# EAGLE design greedy (EAGLE 8.5.0)
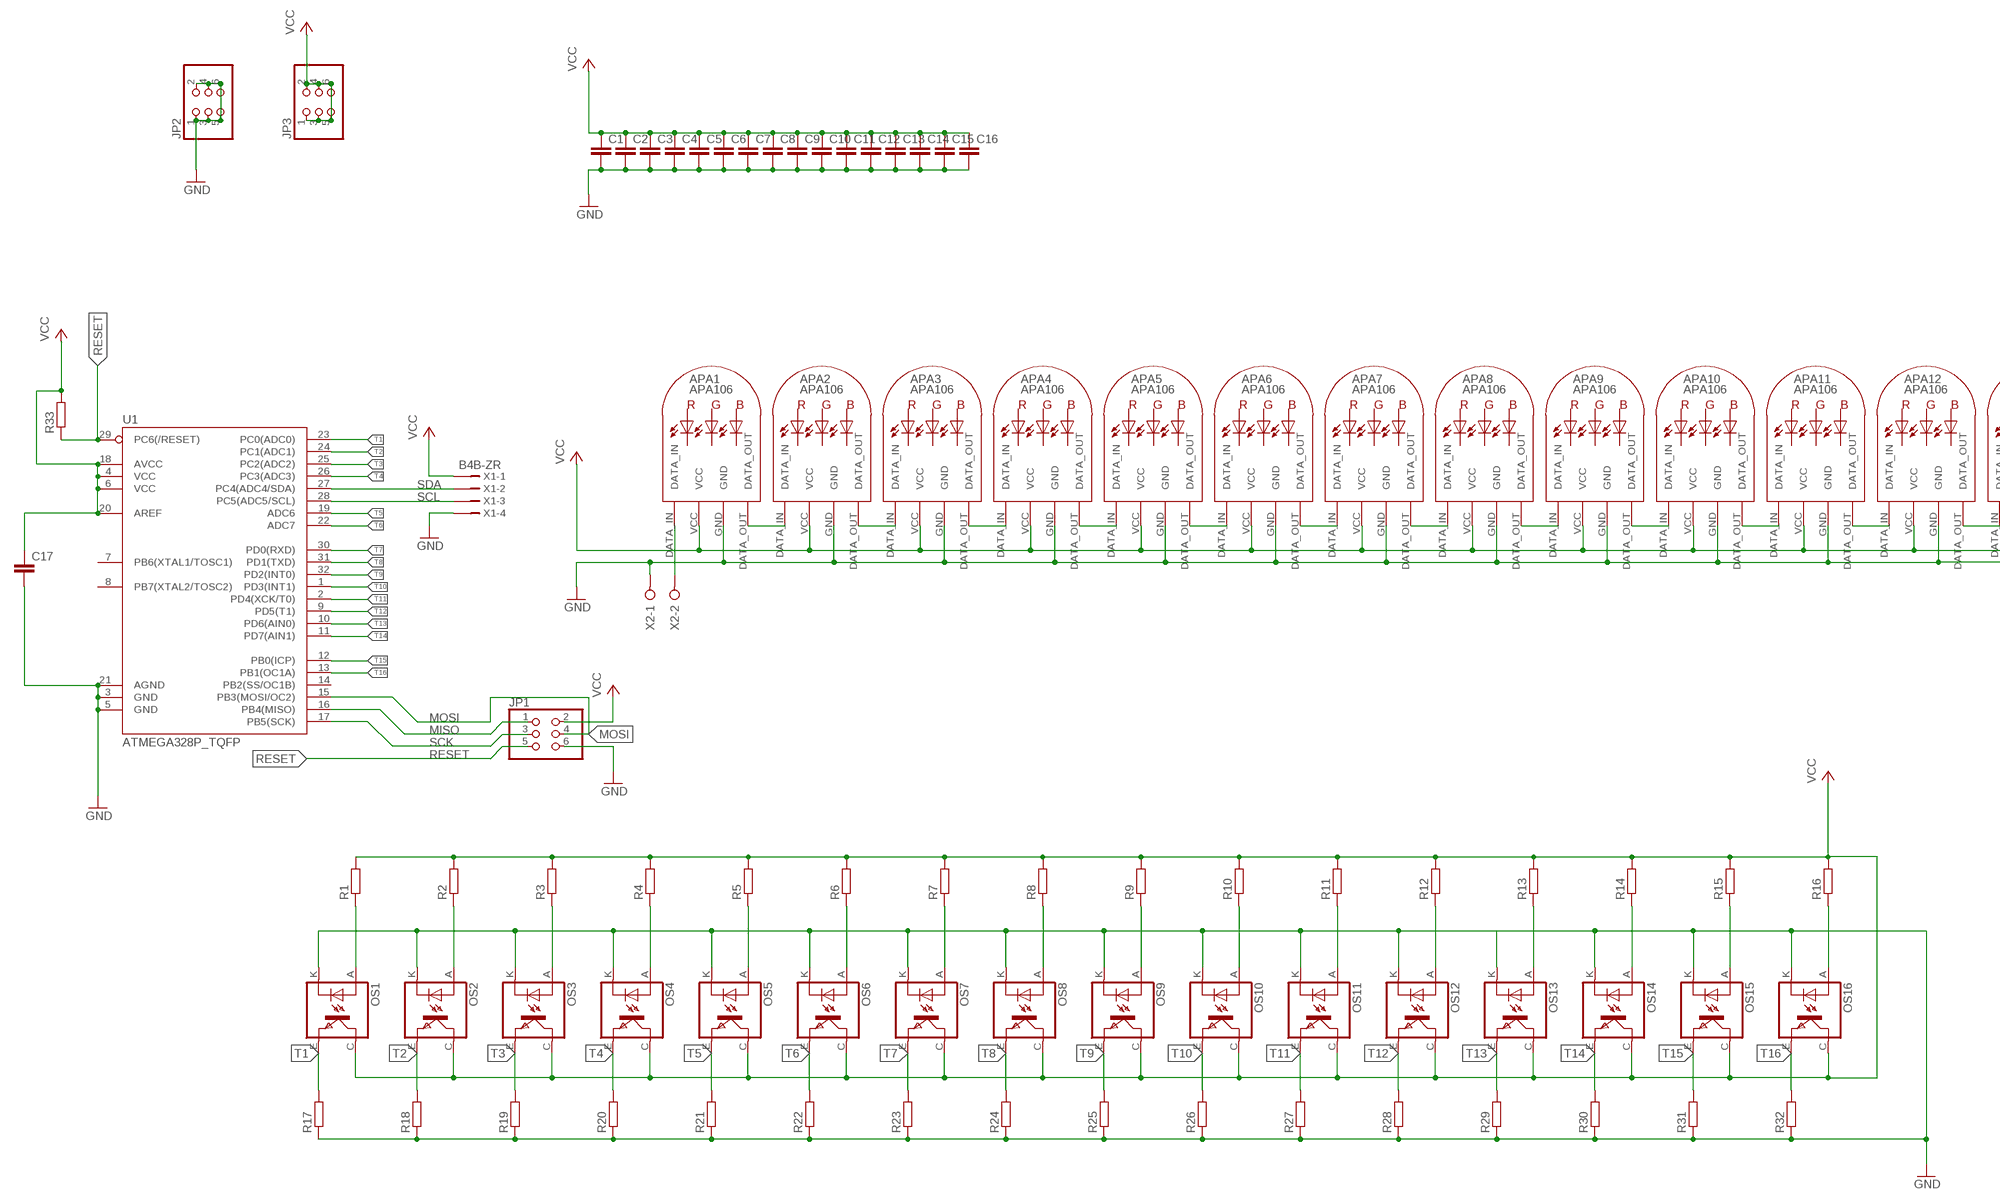
[diagram p0: schematic, sheet 1, part 1 of 2]
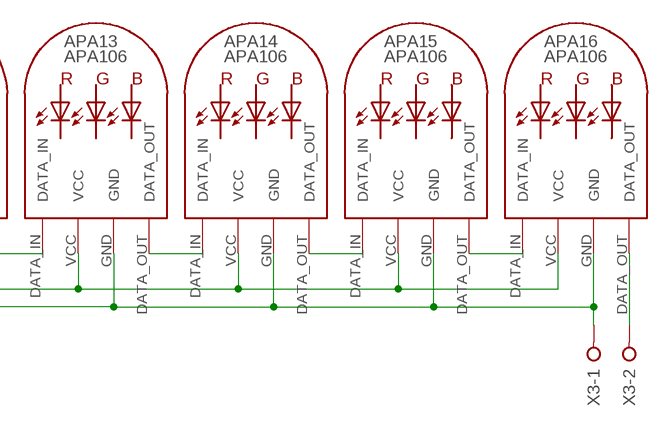
[diagram p1: schematic, sheet 1, part 2 of 2]

## Parts
APA1  APA106  [APA_106_8MM]
APA2  APA106  [APA_106_8MM]
APA3  APA106  [APA_106_8MM]
APA4  APA106  [APA_106_8MM]
APA5  APA106  [APA_106_8MM]
APA6  APA106  [APA_106_8MM]
APA7  APA106  [APA_106_8MM]
APA8  APA106  [APA_106_8MM]
APA9  APA106  [APA_106_8MM]
APA10  APA106  [APA_106_8MM]
APA11  APA106  [APA_106_8MM]
APA12  APA106  [APA_106_8MM]
APA13  APA106  [APA_106_8MM]
APA14  APA106  [APA_106_8MM]
APA15  APA106  [APA_106_8MM]
APA16  APA106  [APA_106_8MM]
C1  C5/3  [C5B3]
C2  C5/3  [C5B3]
C3  C5/3  [C5B3]
C4  C5/3  [C5B3]
C5  C5/3  [C5B3]
C6  C5/3  [C5B3]
C7  C5/3  [C5B3]
C8  C5/3  [C5B3]
C9  C5/3  [C5B3]
C10  C5/3  [C5B3]
C11  C5/3  [C5B3]
C12  C5/3  [C5B3]
C13  C5/3  [C5B3]
C14  C5/3  [C5B3]
C15  C5/3  [C5B3]
C16  C5/3  [C5B3]
C17  C-EU025-025X050  [C025-025X050]
JP1  PINHD-2X3  [2X03]
JP2  PINHD-2X3  [2X03]
JP3  PINHD-2X3  [2X03]
OS1  TCRT5000  [TCRT5000]
OS2  TCRT5000  [TCRT5000]
OS3  TCRT5000  [TCRT5000]
OS4  TCRT5000  [TCRT5000]
OS5  TCRT5000  [TCRT5000]
OS6  TCRT5000  [TCRT5000]
OS7  TCRT5000  [TCRT5000]
OS8  TCRT5000  [TCRT5000]
OS9  TCRT5000  [TCRT5000]
OS10  TCRT5000  [TCRT5000]
OS11  TCRT5000  [TCRT5000]
OS12  TCRT5000  [TCRT5000]
OS13  TCRT5000  [TCRT5000]
OS14  TCRT5000  [TCRT5000]
OS15  TCRT5000  [TCRT5000]
OS16  TCRT5000  [TCRT5000]
R1  R-EU_R0805  [R0805]
R2  R-EU_R0805  [R0805]
R3  R-EU_R0805  [R0805]
R4  R-EU_R0805  [R0805]
R5  R-EU_R0805  [R0805]
R6  R-EU_R0805  [R0805]
R7  R-EU_R0805  [R0805]
R8  R-EU_R0805  [R0805]
R9  R-EU_R0805  [R0805]
R10  R-EU_R0805  [R0805]
R11  R-EU_R0805  [R0805]
R12  R-EU_R0805  [R0805]
R13  R-EU_R0805  [R0805]
R14  R-EU_R0805  [R0805]
R15  R-EU_R0805  [R0805]
R16  R-EU_R0805  [R0805]
R17  R-EU_R0805  [R0805]
R18  R-EU_R0805  [R0805]
R19  R-EU_R0805  [R0805]
R20  R-EU_R0805  [R0805]
R21  R-EU_R0805  [R0805]
R22  R-EU_R0805  [R0805]
R23  R-EU_R0805  [R0805]
R24  R-EU_R0805  [R0805]
R25  R-EU_R0805  [R0805]
R26  R-EU_R0805  [R0805]
R27  R-EU_R0805  [R0805]
R28  R-EU_R0805  [R0805]
R29  R-EU_R0805  [R0805]
R30  R-EU_R0805  [R0805]
R31  R-EU_R0805  [R0805]
R32  R-EU_R0805  [R0805]
R33  R-EU_R0805  [R0805]
U1  ATMEGA328P_TQFP  [TQFP32-08]
X1  B4B-ZR  [B4B-ZR]
X2  W237-02P  [W237-132]
X3  W237-02P  [W237-132]

## Nets
GND: APA1.GND APA2.GND APA3.GND APA4.GND APA5.GND APA6.GND APA7.GND APA8.GND APA9.GND APA10.GND APA11.GND APA12.GND APA13.GND APA14.GND APA15.GND APA16.GND C1.2 C2.2 C3.2 C4.2 C5.2 C6.2 C7.2 C8.2 C9.2 C10.2 C11.2 C12.2 C13.2 C14.2 C15.2 C16.2 C17.2 JP1.6 JP2.1 JP2.2 JP2.3 JP2.4 JP2.5 JP2.6 OS1.K(CATHODE) OS2.K(CATHODE) OS3.K(CATHODE) OS4.K(CATHODE) OS5.K(CATHODE) OS6.K(CATHODE) OS7.K(CATHODE) OS8.K(CATHODE) OS9.K(CATHODE) OS10.K(CATHODE) OS11.K(CATHODE) OS12.K(CATHODE) OS13.K(CATHODE) OS14.K(CATHODE) OS15.K(CATHODE) OS16.K(CATHODE) R17.1 R17.11 R18.1 R18.11 R19.1 R19.11 R20.1 R20.11 R21.1 R21.11 R22.1 R22.11 R23.1 R23.11 R24.1 R24.11 R25.1 R25.11 R26.1 R26.11 R27.1 R27.11 R28.1 R28.11 R29.1 R29.11 R30.1 R30.11 R31.1 R31.11 R32.1 R32.11 U1.3(GND) U1.5(GND) U1.21(AGND) X1.4 X2.1 X3.1
MISO: JP1.1 U1.16(PB4(MISO))
MOSI: JP1.4 U1.15(PB3(MOSI/OC2))
N$1: APA1.DATA_IN X2.2
N$2: OS1.A(ANODE) R1.1 R1.11
N$3: OS2.A(ANODE) R2.1 R2.11
N$4: OS3.A(ANODE) R3.1 R3.11
N$5: OS4.A(ANODE) R4.1 R4.11
N$6: OS5.A(ANODE) R5.1 R5.11
N$7: OS6.A(ANODE) R6.1 R6.11
N$8: OS7.A(ANODE) R7.1 R7.11
N$9: OS8.A(ANODE) R8.1 R8.11
N$10: OS9.A(ANODE) R9.1 R9.11
N$11: OS10.A(ANODE) R10.1 R10.11
N$12: OS11.A(ANODE) R11.1 R11.11
N$13: OS12.A(ANODE) R12.1 R12.11
N$14: OS13.A(ANODE) R13.1 R13.11
N$15: OS14.A(ANODE) R14.1 R14.11
N$16: OS15.A(ANODE) R15.1 R15.11
N$17: OS16.A(ANODE) R16.1 R16.11
N$18: APA16.DATA_OUT X3.2
N$33: APA1.DATA_OUT APA2.DATA_IN
N$34: APA2.DATA_OUT APA3.DATA_IN
N$35: APA3.DATA_OUT APA4.DATA_IN
N$36: APA4.DATA_OUT APA5.DATA_IN
N$37: APA5.DATA_OUT APA6.DATA_IN
N$38: APA6.DATA_OUT APA7.DATA_IN
N$39: APA7.DATA_OUT APA8.DATA_IN
N$40: APA8.DATA_OUT APA9.DATA_IN
N$41: APA9.DATA_OUT APA10.DATA_IN
N$42: APA10.DATA_OUT APA11.DATA_IN
N$43: APA11.DATA_OUT APA12.DATA_IN
N$44: APA12.DATA_OUT APA13.DATA_IN
N$45: APA13.DATA_OUT APA14.DATA_IN
N$46: APA14.DATA_OUT APA15.DATA_IN
N$47: APA15.DATA_OUT APA16.DATA_IN
RESET: JP1.5 R33.1 R33.11 U1.29(PC6(/RESET))
SCK: JP1.3 U1.17(PB5(SCK))
SCL: U1.28(PC5(ADC5/SCL)) X1.3
SDA: U1.27(PC4(ADC4/SDA)) X1.2
T1: OS1.E(EMITTER) R17.2 R17.21 U1.23(PC0(ADC0))
T2: OS2.E(EMITTER) R18.2 R18.21 U1.24(PC1(ADC1))
T3: OS3.E(EMITTER) R19.2 R19.21 U1.25(PC2(ADC2))
T4: OS4.E(EMITTER) R20.2 R20.21 U1.26(PC3(ADC3))
T5: OS5.E(EMITTER) R21.2 R21.21 U1.19(ADC6)
T6: OS6.E(EMITTER) R22.2 R22.21 U1.22(ADC7)
T7: OS7.E(EMITTER) R23.2 R23.21 U1.30(PD0(RXD))
T8: OS8.E(EMITTER) R24.2 R24.21 U1.31(PD1(TXD))
T9: OS9.E(EMITTER) R25.2 R25.21 U1.32(PD2(INT0))
T10: OS10.E(EMITTER) R26.2 R26.21 U1.1(PD3(INT1))
T11: OS11.E(EMITTER) R27.2 R27.21 U1.2(PD4(XCK/T0))
T12: OS12.E(EMITTER) R28.2 R28.21 U1.9(PD5(T1))
T13: OS13.E(EMITTER) R29.2 R29.21 U1.10(PD6(AIN0))
T14: OS14.E(EMITTER) R30.2 R30.21 U1.11(PD7(AIN1))
T15: OS15.E(EMITTER) R31.2 R31.21 U1.12(PB0(ICP))
T16: OS16.E(EMITTER) R32.2 R32.21 U1.13(PB1(OC1A))
VCC: APA1.VCC APA2.VCC APA3.VCC APA4.VCC APA5.VCC APA6.VCC APA7.VCC APA8.VCC APA9.VCC APA10.VCC APA11.VCC APA12.VCC APA13.VCC APA14.VCC APA15.VCC APA16.VCC C1.1 C2.1 C3.1 C4.1 C5.1 C6.1 C7.1 C8.1 C9.1 C10.1 C11.1 C12.1 C13.1 C14.1 C15.1 C16.1 C17.1 JP1.2 JP3.1 JP3.2 JP3.3 JP3.4 JP3.5 JP3.6 OS1.C(COLLECTOR) OS2.C(COLLECTOR) OS3.C(COLLECTOR) OS4.C(COLLECTOR) OS5.C(COLLECTOR) OS6.C(COLLECTOR) OS7.C(COLLECTOR) OS8.C(COLLECTOR) OS9.C(COLLECTOR) OS10.C(COLLECTOR) OS11.C(COLLECTOR) OS12.C(COLLECTOR) OS13.C(COLLECTOR) OS14.C(COLLECTOR) OS15.C(COLLECTOR) OS16.C(COLLECTOR) R1.2 R1.21 R2.2 R2.21 R3.2 R3.21 R4.2 R4.21 R5.2 R5.21 R6.2 R6.21 R7.2 R7.21 R8.2 R8.21 R9.2 R9.21 R10.2 R10.21 R11.2 R11.21 R12.2 R12.21 R13.2 R13.21 R14.2 R14.21 R15.2 R15.21 R16.2 R16.21 R33.2 R33.21 U1.4(VCC) U1.6(VCC) U1.18(AVCC) U1.20(AREF) X1.1
Unconnected: U1.7(PB6(XTAL1/TOSC1)) U1.8(PB7(XTAL2/TOSC2)) U1.14(PB2(SS/OC1B))

## Library data of the parts
APA1-APA16 = apa106:APA106
C1-C16 = capacitor-wima:C: CAPACITOR naming: grid - package width
C17 = rcl:C-EU: CAPACITOR, European symbol; SPICEPREFIX: C
JP1-JP3 = pinhead:PINHD-2X3: PIN HEADER
OS1-OS16 = tcrt5000:TCRT5000
R1-R33 = rcl:R-EU_: RESISTOR, European symbol; SPICEPREFIX: R
U1 = SparkFun-IC-Microcontroller:ATMEGA328P_TQFP: Popular 328P in QFP Storefront component: ATmega328 - TQFP <https://www.sparkfun.com/products/13448> (COM-13448) Datasheet <http://www.sparkfun.com/datasheets/Components/SMD/ATMega328.pdf> SparkFun Products SparkFun RedBoard - Programmed with Arduino <https://www.sparkfun.com/products/12757> (DEV-12757) Arduino Pro Mini 328 - 5V/16MHz <https://www.sparkfun.com/products/11113> (DEV-11113) Arduino Pro Mini 328 - 3.3V/8MHz <https://www.sparkfun.com/products/11114> (DEV-11114) SparkFun OpenLog <https://www.sparkfun.com/products/13712> (DEV-13712) SparkFun MicroView - OLED Arduino Module <https://www.sparkfun.com/products/12923> (DEV-12923) SparkFun Digital Sandbox <https://www.sparkfun.com/products/12651> (DEV-12651) SparkFun PicoBoard <https://www.sparkfun.com/products/11888> (WIG-11888) Arduino Fio <https://www.sparkfun.com/products/10116> (DEV-10116) LilyPad Arduino 328 Main Board <https://www.sparkfun.com/products/13342> (DEV-13342) SparkFun RedStick <https://www.sparkfun.com/products/13741> (DEV-13741) LilyPad MP3 <https://www.sparkfun.com/products/11013> (DEV-11013) LilyPad Arduino SimpleSnap <https://www.sparkfun.com/products/10941> (DEV-10941) SparkFun Stepoko <https://www.sparkfun.com/products/13899> (ROB-13899) SparkFun Geiger Counter <https://www.sparkfun.com/products/11345> (SEN-11345) SparkFun EL Sequencer <https://www.sparkfun.com/products/12781> (COM-12781) Arduino Pro 328 - 5V/16MHz <https://www.sparkfun.com/products/10915> (DEV-10915) CryptoCape <https://www.sparkfun.com/products/12773> (DEV-12773) SparkFun IR Thermometer Evaluation Board - MLX90614 <https://www.sparkfun.com/products/10740> (SEN-10740) SparkFun RedBot Mainboard <https://www.sparkfun.com/products/12097> (ROB-12097) Arduino Pro 328 - 3.3V/8MHz <https://www.sparkfun.com/products/10914> (DEV-10914) SparkFun Block for Intel® Edison - Arduino <https://www.sparkfun.com/products/13036> (DEV-13036) SparkFun Simon Says - Surface Mount Soldering Kit <https://www.sparkfun.com/products/10935> (KIT-10935) SparkFun 7-Segment Serial Display - Red <https://www.sparkfun.com/products/11441> (COM-11441) SparkFun 7-Segment Serial Display - White <https://www.sparkfun.com/products/11629> (COM-11629) SparkFun 7-Segment Serial Display - Yellow <https://www.sparkfun.com/products/11443> (COM-11443) SparkFun 7-Segment Serial Display - Kelly Green <https://www.sparkfun.com/products/11440> (COM-11440) SparkFun 7-Segment Serial Display - Blue <https://www.sparkfun.com/products/11442> (COM-11442) SparkFun OpenSegment Serial Display - 20mm (Blue) <https://www.sparkfun.com/products/11647> (COM-11647) SparkFun OpenSegment Serial Display - 20mm (Green) <https://www.sparkfun.com/products/11646> (COM-11646) SparkFun OpenSegment Serial Display - 20mm (White) <https://www.sparkfun.com/products/11648> (COM-11648) SparkFun OpenSegment Serial Display - 20mm (Red) <https://www.sparkfun.com/products/11644> (COM-11644) SparkFun OpenSegment Serial Display - 20mm (Yellow) <https://www.sparkfun.com/products/11645> (COM-11645) SparkFun OpenSegment Shield <https://www.sparkfun.com/products/13190> (DEV-13190); PROD_ID: IC-09069
X1 = alldevads1262_teensy_ftdi_ref:?4B-ZR: ZH CONNECTOR 1.5 mm, 4 pin 1 row Source: http://www.jst.com .. eZH.pdf; MF: FARNELL; MPN: B4B-ZR(LF)(SN); OC_FARNELL: 1830916; OC_NEWARK: 37K9960
X2 X3 = con-wago-508:W237-02P: WAGO SREW CLAMP; OC_FARNELL: unknown; OC_NEWARK: unknown

## Board
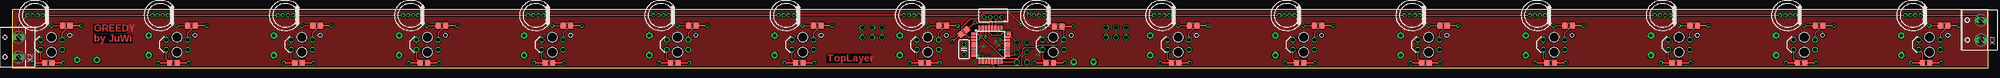
[diagram p2: board, top side]
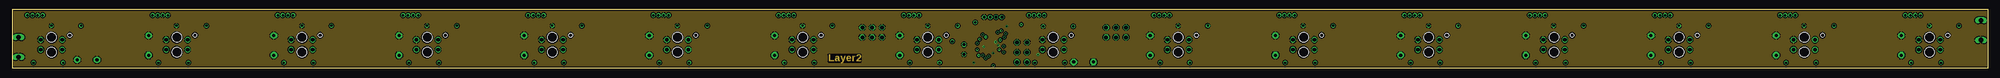
[diagram p3: board, inner layer Route2]
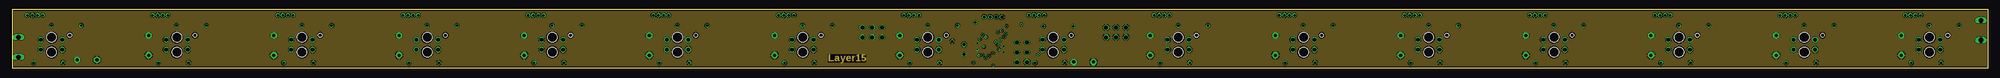
[diagram p4: board, inner layer Route15]
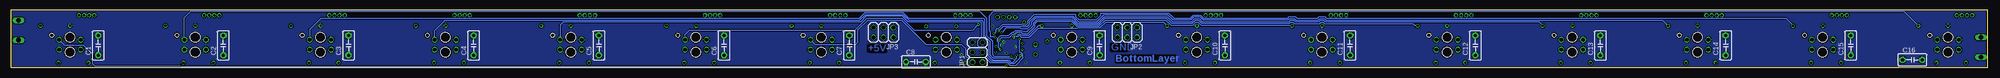
[diagram p5: board, bottom side, seen from below]

Size 505 x 15 mm. Coordinates in mm from the lower left corner, seen from the top.
Outline: 0,0 505,0 505,15 0,15 0,0
Copper layers (1+2*15+16): Top 0.035mm / dielectric 0.39mm / Route2 0.035mm / dielectric 0.39mm / Route15 0.035mm / dielectric 0.39mm / Bottom 0.035mm
Design rules "greedy *": minimum track width 0.15mm, minimum drill 0.35mm, track to track 0.15mm, track to pad 0.15mm, pad to pad 0.15mm, via to via 0.15mm, smd to smd 0mil, copper to edge 0.3mm, drill to drill 0.6mm, minimum pad ring 0.15mm, minimum via ring 0.15mm, stop-mask expansion 0.01mm, vias tented up to drill 32mil, thermal gap 10mil

### Footprints (pad centres in the part's own frame; a part is rotated, then mirrored left to right if it is on the bottom)
APA_106_8MM = drill 0.6 pad 1: DATA_IN -1.95,0; DATA_OUT 1.95,0; GND 0.65,0; VCC -0.65,0
C5B3 = drill 0.813 pad 1.6 octagon: 1 -2.54,0; 2 2.54,0
C025-025X050 = drill 0.813 octagon: 1 -1.27,0; 2 1.27,0
2X03 = drill 1.016 octagon: 1 -2.54,-1.27; 2 -2.54,1.27; 3 0,-1.27; 4 0,1.27; 5 2.54,-1.27; 6 2.54,1.27
TCRT5000 = drill 1: A -2.75,-1.27; K -2.75,1.27 | drill 1 octagon: C 2.75,-1.27; E 2.75,1.27 | hole 2.5: 0,-1.9; 0,1.9 | hole 1: 4.65,2.45
R0805 = smd 1.3 x 1.5: 1 -0.95,0; 2 0.95,0 | drill 0.6: 11 -3.81,0; 21 3.81,0
TQFP32-08 = smd 1.27 x 0.559: 1 -4.293,2.8; 2 -4.293,2; 3 -4.293,1.2; 4 -4.293,0.4; 5 -4.293,-0.4; 6 -4.293,-1.2; 7 -4.293,-2; 8 -4.293,-2.8; 17 4.293,-2.8; 18 4.293,-2; 19 4.293,-1.2; 20 4.293,-0.4; 21 4.293,0.4; 22 4.293,1.2; 23 4.293,2; 24 4.293,2.8 | smd 0.559 x 1.27: 9 -2.8,-4.293; 10 -2,-4.293; 11 -1.2,-4.293; 12 -0.4,-4.293; 13 0.4,-4.293; 14 1.2,-4.293; 15 2,-4.293; 16 2.8,-4.293; 25 2.8,4.293; 26 2,4.293; 27 1.2,4.293; 28 0.4,4.293; 29 -0.4,4.293; 30 -1.2,4.293; 31 -2,4.293; 32 -2.8,4.293
B4B-ZR = drill 0.7 pad 1.1: 1 -2.25,0; 2 -0.75,0; 3 0.75,0; 4 2.25,0
W237-132 = drill 1.194 long: 1 -2.54,-0.635; 2 2.54,-0.635

### Placement (x,y rotation side)
APA1  5.76,13.56 0 top
APA2  37.76,13.56 0 top
APA3  69.76,13.56 0 top
APA4  101.76,13.56 0 top
APA5  133.76,13.56 0 top
APA6  165.76,13.56 0 top
APA7  197.76,13.56 0 top
APA8  229.76,13.56 0 top
APA9  261.76,13.56 0 top
APA10  293.76,13.56 0 top
APA11  325.76,13.56 0 top
APA12  357.76,13.56 0 top
APA13  389.76,13.56 0 top
APA14  421.76,13.56 0 top
APA15  453.76,13.56 0 top
APA16  485.76,13.56 0 top
C1  482.8,5.83 90 bottom
C2  450.8,5.83 90 bottom
C3  418.8,5.83 90 bottom
C4  386.8,5.83 90 bottom
C5  354.8,5.83 90 bottom
C6  322.8,5.83 90 bottom
C7  290.8,5.83 90 bottom
C8  273.78,1.55 0 bottom
C9  226.8,5.83 90 bottom
C10  194.8,5.83 90 bottom
C11  162.8,5.83 90 bottom
C12  130.8,5.83 90 bottom
C13  98.8,5.83 90 bottom
C14  66.8,5.83 90 bottom
C15  34.8,5.83 90 bottom
C16  19.07,2.09 0 bottom
C17  243.23,4.78 270 top
JP1  258.06,4.06 90 bottom
JP2  219.76,9.17 180 bottom
JP3  282.09,9.17 180 bottom
OS1  10,6 0 top
OS2  42,6 0 top
OS3  74,6 0 top
OS4  106,6 0 top
OS5  138,6 0 top
OS6  170,6 0 top
OS7  202,6 0 top
OS8  234,6 0 top
OS9  266,6 0 top
OS10  298,6 0 top
OS11  330,6 0 top
OS12  362,6 0 top
OS13  394,6 0 top
OS14  426,6 0 top
OS15  458,6 0 top
OS16  490,6 0 top
R1  9.14,1.36 0 top
R2  41.14,1.36 0 top
R3  73.14,1.36 0 top
R4  105.14,1.36 0 top
R5  137.14,1.36 0 top
R6  169.14,1.36 0 top
R7  201.14,1.36 0 top
R8  233.14,1.36 0 top
R9  265.14,1.36 0 top
R10  297.14,1.36 0 top
R11  329.14,1.36 0 top
R12  361.14,1.36 0 top
R13  393.14,1.36 0 top
R14  425.14,1.36 0 top
R15  457.14,1.36 0 top
R16  489.14,1.36 0 top
R17  13.75,10.91 0 top
R18  45.75,10.91 0 top
R19  77.75,10.91 0 top
R20  109.75,10.91 0 top
R21  141.75,10.91 0 top
R22  173.75,10.91 0 top
R23  205.75,10.91 0 top
R24  237.75,10.91 0 top
R25  267.32,10.7 0 top
R26  301.75,10.91 0 top
R27  333.75,10.91 0 top
R28  365.75,10.91 0 top
R29  397.75,10.91 0 top
R30  429.75,10.91 0 top
R31  461.75,10.91 0 top
R32  493.75,10.91 0 top
R33  243.17,9.3 220 top
U1  250,6 0 top
X1  250.65,13.11 180 top
X2  0.91,5.38 90 top
X3  502.51,9.75 90 top

### Tracks (layer width: path | path; a pad name or v marks a point on that pad's centre or on a via)
GND  (via drill 0.35)
  other vias: 248.31,5.44 250.65,3.81 251.31,6.71 251.92,5.84 245.67,1.37 254.15,10.77 262.13,3.45
  pour Bottom (isolate 0.254, rank 6): 0,15 505,15 505,0 0,0
  pour Route2 (isolate 0.254): 0,15 505,15 505,0 0,0
  pour Top (isolate 0.254): 0,15 505,15 505,0 0,0
  pour Route2 (isolate 0.254): 0,15 505,15 505,0 0,0
  cutout Bottom: 219.2,4.27 224.08,4.27 224.08,6.3 219.2,6.3
  cutout Bottom: 286.11,6.1 281.23,6.1 281.23,4.06 286.11,4.06
MISO
  Top 0.254: JP1.1 252.98,1.52 U1.16
MOSI
  Top 0.254: JP1.4 257.96,2.69 257.96,0.61 257.86,0.51 252.07,0.51 251.97,0.61 251.97,1.68 U1.15
N$1
  Top 0.254: APA1.DATA_IN 1.55,10.98 X2.2
N$2
  Top 0.254: OS1.A 7.25,2.3 R1.1 R1.11
N$3
  Top 0.254: OS2.A 39.25,2.3 R2.1 R2.11
N$4
  Top 0.254: OS3.A 71.25,2.3 R3.1 R3.11
N$5
  Top 0.254: OS4.A 103.25,2.3 R4.1 R4.11
N$6
  Top 0.254: OS5.A 135.25,2.3 R5.1 R5.11
N$7
  Top 0.254: OS6.A 167.25,2.3 R6.1 R6.11
N$8
  Top 0.254: OS7.A 199.25,2.3 R7.1 R7.11
N$9
  Top 0.254: OS8.A 231.25,2.3 R8.1 R8.11
N$10
  Top 0.254: OS9.A 263.25,2.3 R9.1 R9.11
N$11
  Top 0.254: OS10.A 295.25,2.3 R10.1 R10.11
N$12
  Top 0.254: OS11.A 327.25,2.3 R11.1 R11.11
N$13
  Top 0.254: OS12.A 359.25,2.3 R12.1 R12.11
N$14
  Top 0.254: OS13.A 391.25,2.3 R13.1 R13.11
N$15
  Top 0.254: OS14.A 423.25,2.3 R14.1 R14.11
N$16
  Top 0.254: OS15.A 455.25,2.3 R15.1 R15.11
N$17
  Top 0.254: OS16.A 488.09,3.89 488.09,1.25 | 488.09,0.71 488.09,1.25 | 488.09,1.25 R16.1 R16.11
N$18
  Top 0.254: APA16.DATA_OUT 501.88,13.56 X3.2
N$33
  Top 0.254: APA1.DATA_OUT APA2.DATA_IN
N$34
  Top 0.254: APA2.DATA_OUT APA3.DATA_IN
N$35
  Top 0.254: APA3.DATA_OUT APA4.DATA_IN
N$36
  Top 0.254: APA4.DATA_OUT APA5.DATA_IN
N$37
  Top 0.254: APA5.DATA_OUT APA6.DATA_IN
N$38
  Top 0.254: APA6.DATA_OUT APA7.DATA_IN
N$39
  Top 0.254: APA8.DATA_IN APA7.DATA_OUT
N$40
  Top 0.254: APA8.DATA_OUT 246.73,13.56 247.62,14.44 259.25,14.44 APA9.DATA_IN
N$41
  Top 0.254: APA9.DATA_OUT APA10.DATA_IN
N$42
  Top 0.254: APA10.DATA_OUT APA11.DATA_IN
N$43
  Top 0.254: APA11.DATA_OUT APA12.DATA_IN
N$44
  Top 0.254: APA12.DATA_OUT APA13.DATA_IN
N$45
  Top 0.254: APA13.DATA_OUT APA14.DATA_IN
N$46
  Top 0.254: APA14.DATA_OUT APA15.DATA_IN
N$47
  Top 0.254: APA15.DATA_OUT APA16.DATA_IN
RESET
  Top 0.254: JP1.5 255.26,8.14 255.26,9.22 255.06,9.41 253.55,9.41 253.14,9 252.53,8.38 250.39,8.38 249.6,9.18 U1.29 249.6,11.74 R33.11 R33.1
SCK
  Top 0.254: JP1.3 255.93,3.2 U1.17
SCL
  Top 0.254: X1.3 249.9,12.33 250.34,11.89 250.34,10.35 U1.28
SDA
  Top 0.254: X1.2 251.2,12.91 U1.27
T1  (via drill 0.35)
  Top 0.254: OS1.E 12.75,8.95 R17.2 R17.21 | v253.46,7.95 254.25,7.95 U1.23
  Bottom 0.254: R17.21 21.14,14.48 254.05,14.48 255.12,13.41 255.12,9.75 254.81,9.34 254.81,8.15 254,8.15 253.72,8.15 253.49,7.92 v253.46,7.95
T2  (via drill 0.35)
  Top 0.254: OS2.E 44.75,8.95 R18.2 R18.21 | v253.9,8.8 253.79,8.8 U1.24
  Bottom 0.254: R18.21 51.36,12.7 168.69,12.7 169.05,13.06 170.84,13.06 171.2,12.7 176.31,12.7 176.67,13.06 178.57,13.06 178.88,12.75 200.1,12.75 200.86,13.52 203.03,13.52 203.79,12.75 207.72,12.75 208.48,13.52 208.64,13.52 209.14,14.02 226.57,14.02 226.57,13.41 227.69,12.29 232.01,12.29 232.87,13.14 232.87,13.72 243.58,13.72 245.28,12.02 245.28,11.41 245.75,10.94 246.39,10.94 246.63,11.18 251.67,11.18 252.64,10.21 253.01,10.21 253.34,9.88 253.34,9.85 253.38,9.8 253.38,9.12 v253.9,8.8
T3  (via drill 0.35)
  Top 0.254: OS3.E 76.75,8.95 R19.2 R19.21 | v252.78,9.55 252.78,10.27 U1.25
  Bottom 0.254: R19.21 82.9,12.24 168.88,12.24 169.24,12.6 170.65,12.6 171.01,12.24 176.5,12.24 176.86,12.6 178.38,12.6 178.69,12.29 200.28,12.29 201.05,13.06 202.84,13.06 203.6,12.29 207.91,12.29 208.67,13.06 208.83,13.06 209.33,13.56 225.84,13.56 227.57,11.84 232.13,11.84 233.56,13.26 243.39,13.26 244.82,11.83 244.82,11.22 245.56,10.48 246.58,10.48 246.82,10.72 247.14,10.72 | v252.78,9.55 252.65,9.55 251.48,10.72 247.14,10.72 | 247.14,10.72
T4  (via drill 0.35)
  Top 0.254: OS4.E 108.75,8.95 R20.2 R20.21 | U1.26 v251.82,9.2
  Bottom 0.254: R20.21 114.44,11.79 169.07,11.79 169.43,12.14 170.46,12.14 170.82,11.79 176.69,11.79 177.05,12.14 178.19,12.14 178.5,11.84 200.47,11.84 201.24,12.6 202.65,12.6 203.41,11.84 208.09,11.84 208.86,12.6 209.02,12.6 209.52,13.11 225.73,13.11 227.4,11.44 232.3,11.44 233.67,12.8 243.2,12.8 244.37,11.64 244.37,11.03 245.38,10.02 246.77,10.02 247.01,10.26 250.75,10.26 v251.82,9.2
T5  (via drill 0.35)
  Top 0.254: OS5.E 140.75,8.95 R21.2 R21.21 | U1.19 254.27,4.78 v252.17,4.78
  Bottom 0.254: R21.21 146.24,10.91 146.66,11.33 169.26,11.33 169.62,11.69 170.27,11.69 170.63,11.33 176.88,11.33 177.24,11.69 178,11.69 178.31,11.38 200.66,11.38 201.43,12.14 202.46,12.14 203.22,11.38 208.28,11.38 209.05,12.14 209.21,12.14 209.71,12.65 225.62,12.65 227.23,11.03 232.47,11.03 233.78,12.34 243.01,12.34 243.91,11.45 243.91,10.84 245.51,9.25 246.19,9.25 246.5,9.55 248.43,9.55 248.83,9.14 249.24,9.14 250.2,8.18 252.3,8.18 252.66,7.82 252.72,7.82 253.08,7.46 253.08,6.96 252.79,6.67 252.79,5.39 v252.17,4.78
T6  (via drill 0.35)
  Top 0.254: OS6.E 172.75,8.95 R22.2 R22.21 | v252.48,7.21 252.59,7.2 U1.22
  Bottom 0.254: R22.21 200.84,10.91 201.62,11.69 202.27,11.69 203.05,10.91 208.46,10.91 209.24,11.69 209.4,11.69 209.9,12.19 225.5,12.19 227.07,10.63 232.64,10.63 233.9,11.89 242.82,11.89 243.43,11.28 243.43,10.67 243.66,10.45 | v252.48,7.21 251.97,7.72 249.98,7.72 249.37,8.36 249.05,8.68 248.64,8.68 248.61,8.72 248.61,8.78 248.25,9.14 246.73,9.14 246.38,8.79 245.31,8.79 243.66,10.45 | 243.66,10.45
T7  (via drill 0.35)
  Top 0.254: OS7.E 204.75,8.95 R23.2 R23.21 | U1.30 248.82,10.27 248.82,8.13 v248.82,7.98
  Bottom 0.254: R23.21 210.39,11.73 225.39,11.73 226.9,10.22 232.48,10.22 232.58,10.12 242.62,10.12 244.87,7.87 246.76,7.87 247.06,8.18 247.51,8.18 247.76,7.93 248.25,7.93 248.45,8.13 248.82,8.13 v248.82,7.98
T8  (via drill 0.35)
  Top 0.254: OS8.E 236.75,8.95 R24.2 R24.21 | U1.31 v248.01,8.53
  Bottom 0.254: R24.21 242.49,10.91 245.06,8.33 246.57,8.33 246.88,8.63 247.71,8.63 247.81,8.53 v248.01,8.53
T9
  Top 0.254: OS9.E 268.75,7.32 | 268.75,7.32 268.75,10.22 R25.2 R25.21 | 268.75,7.32 267.43,5.99 262.23,5.99 261.52,5.28 258.67,5.28 258.27,4.88 258.27,3.86 256.95,2.54 253.49,2.54 253.09,2.95 252.74,2.95 247.4,8.29 247.4,9.26 247.2,9.47 U1.32
T10  (via drill 0.35)
  Top 0.254: OS10.E 300.75,8.95 R26.2 R26.21 | U1.1 247,8.8 247,8.12 247.29,7.82 v247.29,7.42
  Bottom 0.254: OS10.E 299.58,6.1 289.15,6.1 288.6,6.66 288.6,9.85 286.06,12.39 277.51,12.39 271.17,6.04 262.08,6.04 261.06,5.03 261.06,3.1 260.76,2.79 256.18,2.79 254.71,1.32 250.37,1.32 249.66,0.61 248.38,0.61 246.39,2.56 246.39,3.5 246.89,4.01 247.29,4.01 v247.29,7.42 247.24,7.42
T11  (via drill 0.35)
  Top 0.152: U1.2 244.37,8 243.74,8.64 242.57,10.01 242.52,10.16
  Top 0.254: OS11.E 332.75,8.95 R27.2 R27.21 | v257.86,11.18 255,13.99 248.03,13.99 246.6,12.55 244.69,12.55 242.52,10.38 242.52,10.16 | 245.68,8.03 U1.2
  Bottom 0.254: OS11.E 332.75,8.68 331.62,9.8 289.34,9.8 286.3,12.84 277.32,12.84 274.23,9.75 259.23,9.75 v257.86,11.18
T12  (via drill 0.35)
  Top 0.254: OS12.E 364.75,8.95 R28.2 R28.21 | U1.9 247.2,3.09 v247.04,3.25
  Bottom 0.254: OS12.E 364.75,11.02 363.93,11.84 287.96,11.84 286.49,13.3 277.18,13.3 275.72,11.84 257.2,11.84 257.05,11.68 257.05,7.98 257.91,7.11 257.91,5.69 257.66,5.44 256.13,5.44 255.63,4.93 255.63,2.91 254.44,1.73 250.21,1.73 249.55,1.07 248.65,1.07 247.29,2.43 247.29,3 v247.04,3.25
T13  (via drill 0.35)
  Top 0.254: OS13.E 396.75,8.95 R29.2 R29.21 | U1.10 248.05,2.98 v248.04,3.3
  Bottom 0.254: OS13.E 396.75,9.6 394.06,12.29 288.15,12.29 286.68,13.76 277.07,13.76 275.6,12.29 256.9,12.29 256.59,11.99 256.59,7.98 255.17,6.55 255.17,3.1 254.2,2.13 250.04,2.13 249.44,1.53 248.95,1.53 248.01,2.47 248.01,2.59 v248.04,3.3
T14  (via drill 0.35)
  Top 0.254: OS14.E 428.75,8.95 R30.2 R30.21 | 248.82,1.73 U1.11 248.8,2.52 v248.78,2.54
  Bottom 0.254: OS14.E 428.75,9.91 425.91,12.75 288.34,12.75 286.92,14.17 276.91,14.17 275.49,12.75 256.39,12.75 256.13,12.5 256.13,8.16 254.71,6.74 254.71,3.29 253.96,2.54 250.21,2.54 250.2,2.53 249.87,2.53 249.65,2.31 249.03,2.31 249.03,2.33 248.82,2.54 v248.78,2.54
T15  (via drill 0.35)
  Top 0.254: OS15.E 460.75,8.95 R31.2 R31.21 | U1.12 249.58,1.73 249.59,1.73 v249.59,3.1
  Bottom 0.254: OS15.E 460.75,13.01 459.09,14.57 287.09,14.57 287.08,14.57 276.74,14.57 257.5,14.57 255.68,12.85 255.68,8.35 254.25,6.93 254.25,3.48 253.77,3 249.79,3 v249.59,3.1 249.59,2.89 249.58,2.89
T16  (via drill 0.35)
  Top 0.254: OS16.E 492.75,8.73 494.7,10.68 R32.2 R32.21 | v250.7,0.62 250.39,0.93 U1.13
  Bottom 0.254: OS16.E 491.47,5.99 486.66,5.99 484.28,3.61 484.28,1.22 483.67,0.61 461.77,0.61 461.58,0.47 251,0.46 v250.7,0.62
VCC  (via drill 0.35)
  Top 0.254: U1.18 253.45,4 v253.39,4.06 | U1.20 253.4,5.6 v253.39,5.59 | U1.6 246.56,4.8 v246.58,4.78 | U1.4 v246.58,6.4 | R14.2 R14.21 | R3.2 R3.21 | R13.2 R13.21 | R16.2 R16.21 | R12.2 R12.21 | R10.2 R10.21 | R1.2 R1.21 | R9.2 R9.21 | R11.2 R11.21 | R4.2 R4.21 | R33.2 R33.21 | R8.2 R8.21 | R15.2 R15.21 | R7.2 R7.21 | R6.2 R6.21 | R5.2 R5.21 | R2.2 R2.21
  pour Route15: 0,15 505,15 505,0 0,0
  pour Bottom (rank 2): 278.18,11.79 285.9,11.79 285.9,6.71 278.18,6.71

### Text on the board
Top: GREEDY | by JuWi | TopLayer
Route2: Layer2
Route15: Layer15
Bottom: +5V | GND | BottomLayer